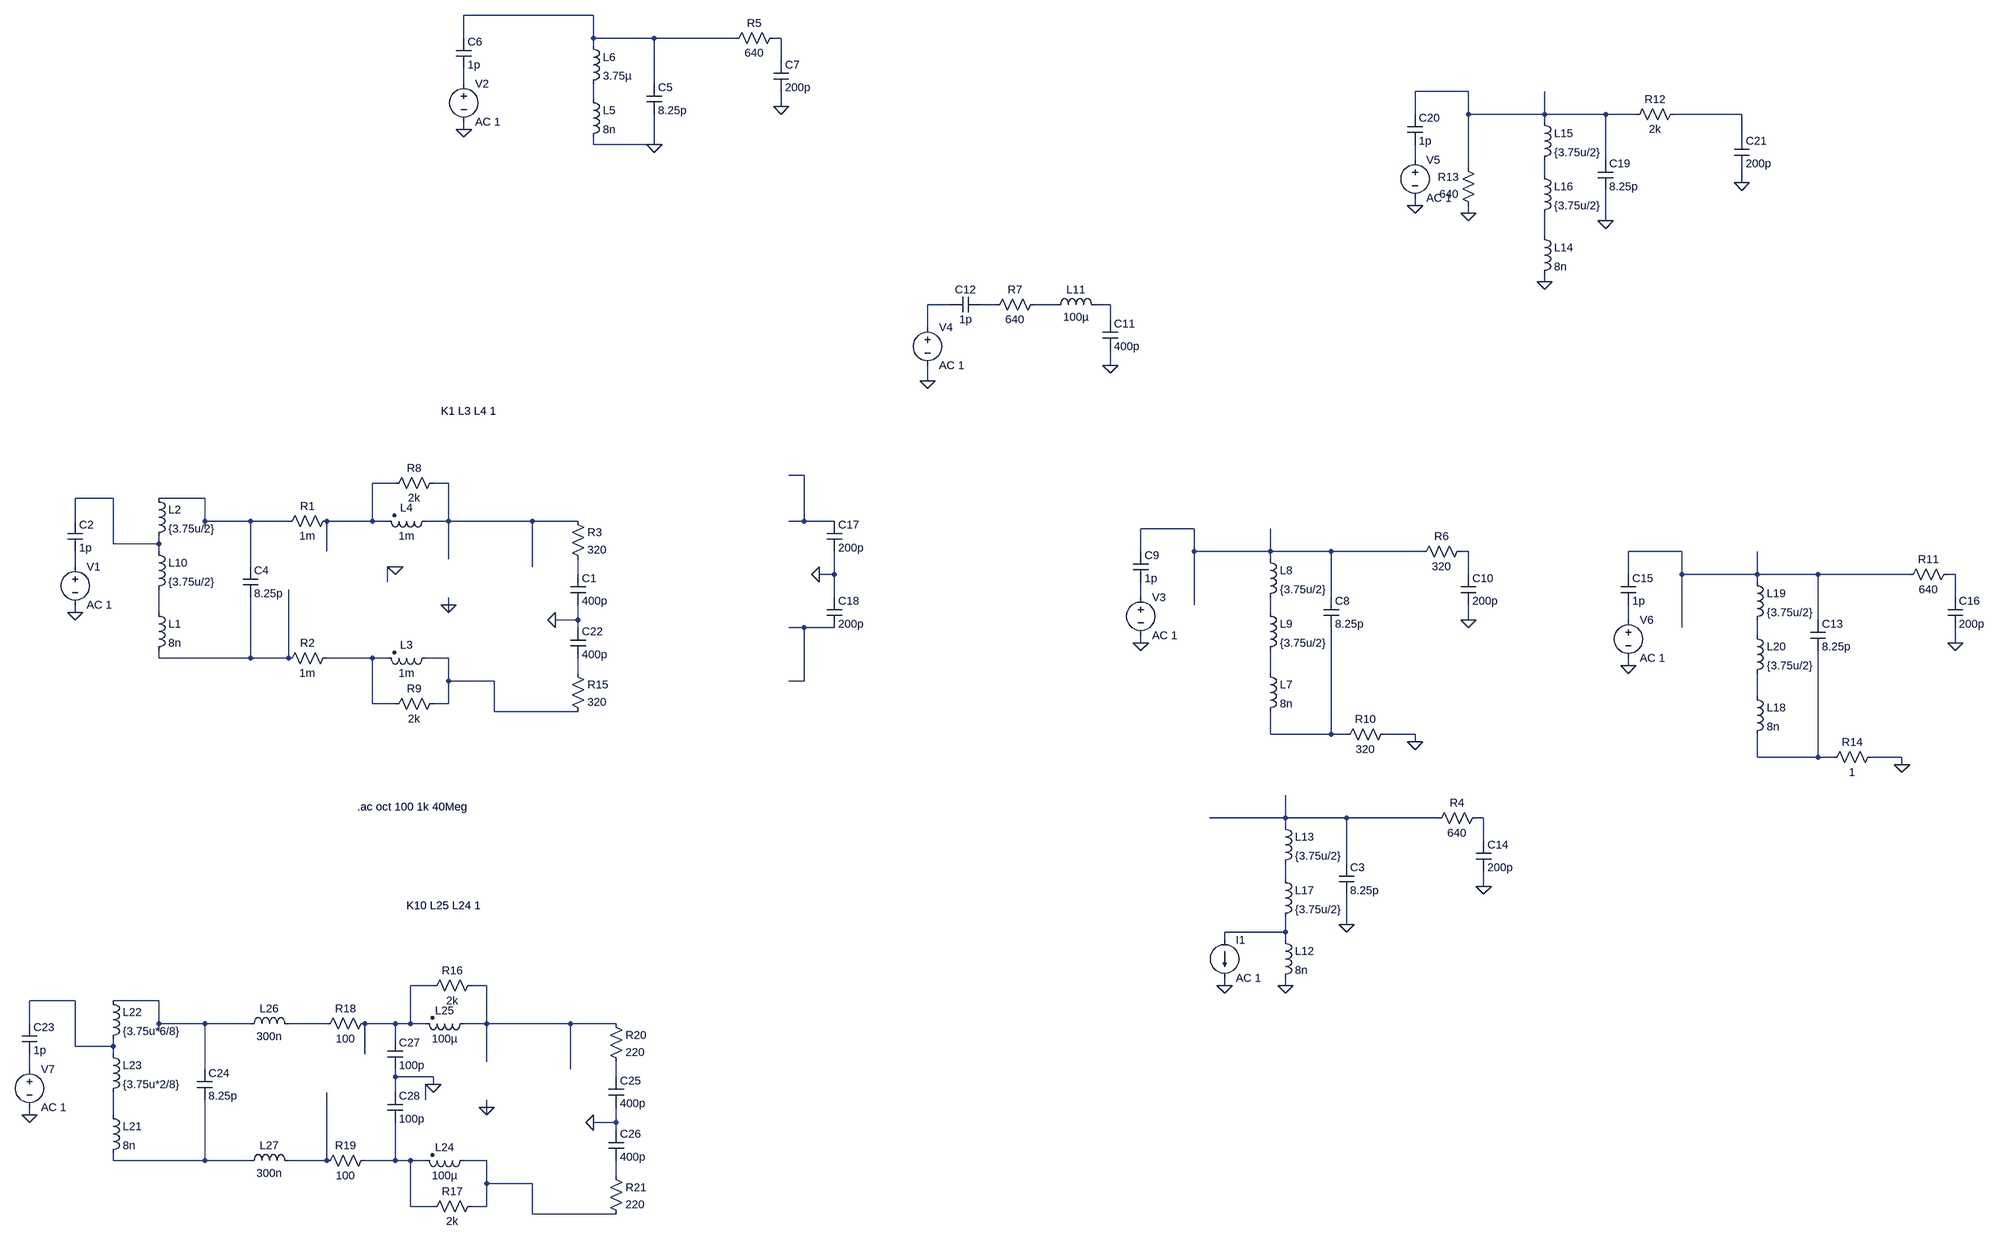
[diagram p0: schematic coil_sim.asc]
coil_sim.asc, the LTspice schematic file:
Version 4
SHEET 1 3080 1456
WIRE 48 -1120 -224 -1120
WIRE -224 -1072 -224 -1120
WIRE 48 -1072 48 -1120
WIRE 176 -1072 48 -1072
WIRE 368 -1072 176 -1072
WIRE 464 -1072 448 -1072
WIRE 48 -1056 48 -1072
WIRE 464 -1024 464 -1072
WIRE -224 -976 -224 -1008
WIRE 176 -976 176 -1072
WIRE 1984 -960 1872 -960
WIRE 48 -944 48 -976
WIRE 464 -928 464 -960
WIRE 1872 -912 1872 -960
WIRE 1984 -912 1984 -960
WIRE 2144 -912 2144 -960
WIRE 2144 -912 1984 -912
WIRE 2272 -912 2144 -912
WIRE 2336 -912 2272 -912
WIRE 2560 -912 2416 -912
WIRE 2144 -896 2144 -912
WIRE -224 -880 -224 -896
WIRE 2560 -864 2560 -912
WIRE 48 -848 48 -864
WIRE 176 -848 176 -912
WIRE 176 -848 48 -848
WIRE 1872 -816 1872 -848
WIRE 2272 -816 2272 -912
WIRE 1984 -800 1984 -912
WIRE 2144 -784 2144 -816
WIRE 2560 -768 2560 -800
WIRE 1872 -720 1872 -736
WIRE 1984 -704 1984 -720
WIRE 2272 -688 2272 -752
WIRE 2144 -656 2144 -704
WIRE 2144 -560 2144 -576
WIRE 896 -512 848 -512
WIRE 992 -512 960 -512
WIRE 1120 -512 1072 -512
WIRE 1232 -512 1200 -512
WIRE 1232 -480 1232 -512
WIRE 848 -464 848 -512
WIRE 1232 -384 1232 -416
WIRE 848 -352 848 -384
WIRE 512 -128 480 -128
WIRE -368 -112 -416 -112
WIRE -256 -112 -288 -112
WIRE -960 -80 -1040 -80
WIRE -768 -80 -864 -80
WIRE -1040 -32 -1040 -80
WIRE -768 -32 -768 -80
WIRE -672 -32 -768 -32
WIRE -592 -32 -672 -32
WIRE -416 -32 -416 -112
WIRE -416 -32 -512 -32
WIRE -384 -32 -416 -32
WIRE -256 -32 -256 -112
WIRE -256 -32 -304 -32
WIRE -80 -32 -256 -32
WIRE 16 -32 -80 -32
WIRE 512 -32 512 -128
WIRE 512 -32 480 -32
WIRE 576 -32 512 -32
WIRE -768 -16 -768 -32
WIRE 1408 -16 1296 -16
WIRE -960 16 -960 -80
WIRE -864 16 -864 0
WIRE -864 16 -960 16
WIRE -864 32 -864 16
WIRE -512 32 -512 -32
WIRE 1296 32 1296 -16
WIRE 1408 32 1408 -16
WIRE 1568 32 1568 -16
WIRE 1568 32 1408 32
WIRE 1696 32 1568 32
WIRE 1888 32 1696 32
WIRE 1984 32 1968 32
WIRE 2432 32 2320 32
WIRE -256 48 -256 -32
WIRE 1568 48 1568 32
WIRE -1040 64 -1040 32
WIRE -672 64 -672 -32
WIRE -80 64 -80 -32
WIRE 16 80 16 48
WIRE 576 80 576 32
WIRE 576 80 544 80
WIRE 1984 80 1984 32
WIRE 2320 80 2320 32
WIRE 2432 80 2432 32
WIRE 2592 80 2592 32
WIRE 2592 80 2432 80
WIRE 2720 80 2592 80
WIRE 2912 80 2720 80
WIRE 3008 80 2992 80
WIRE -384 96 -384 64
WIRE 2592 96 2592 80
WIRE 576 128 576 80
WIRE 1296 128 1296 96
WIRE 1696 128 1696 32
WIRE 3008 128 3008 80
WIRE -256 144 -256 128
WIRE 1408 144 1408 32
WIRE -1040 160 -1040 144
WIRE -864 160 -864 112
WIRE -256 160 -256 144
WIRE 1568 160 1568 128
WIRE 16 176 16 144
WIRE 16 176 -32 176
WIRE 1984 176 1984 144
WIRE 2320 176 2320 144
WIRE 2720 176 2720 80
WIRE 16 192 16 176
WIRE 512 192 480 192
WIRE 576 192 512 192
WIRE 2432 192 2432 80
WIRE 2592 208 2592 176
WIRE 1296 224 1296 208
WIRE 3008 224 3008 192
WIRE -864 256 -864 240
WIRE -672 256 -672 128
WIRE -672 256 -864 256
WIRE -592 256 -592 112
WIRE -592 256 -672 256
WIRE -416 256 -512 256
WIRE -384 256 -416 256
WIRE -256 256 -304 256
WIRE 2320 272 2320 256
WIRE 16 288 16 256
WIRE 1568 288 1568 240
WIRE -256 304 -256 256
WIRE -160 304 -256 304
WIRE 512 304 512 192
WIRE 512 304 480 304
WIRE 2592 336 2592 288
WIRE -416 352 -416 256
WIRE -368 352 -416 352
WIRE -256 352 -256 304
WIRE -256 352 -288 352
WIRE -160 368 -160 304
WIRE 16 368 -160 368
WIRE 1568 416 1568 368
WIRE 1696 416 1696 192
WIRE 1696 416 1568 416
WIRE 1728 416 1696 416
WIRE 1872 416 1808 416
WIRE 1872 432 1872 416
WIRE 2592 464 2592 416
WIRE 2720 464 2720 240
WIRE 2720 464 2592 464
WIRE 2752 464 2720 464
WIRE 2896 464 2832 464
WIRE 2896 480 2896 464
WIRE 1600 592 1600 544
WIRE 1600 592 1440 592
WIRE 1728 592 1600 592
WIRE 1920 592 1728 592
WIRE 2016 592 2000 592
WIRE 1600 608 1600 592
WIRE 2016 640 2016 592
WIRE 1728 688 1728 592
WIRE 1600 720 1600 688
WIRE 2016 736 2016 704
WIRE 1728 816 1728 752
WIRE 1600 832 1600 800
WIRE 1600 832 1472 832
WIRE 1472 848 1472 832
WIRE 1600 848 1600 832
WIRE -288 944 -336 944
WIRE -176 944 -208 944
WIRE 1472 944 1472 928
WIRE 1600 944 1600 928
WIRE -1040 976 -1136 976
WIRE -864 976 -960 976
WIRE -1136 1024 -1136 976
WIRE -864 1024 -864 976
WIRE -768 1024 -864 1024
WIRE -672 1024 -768 1024
WIRE -512 1024 -592 1024
WIRE -368 1024 -432 1024
WIRE -336 1024 -336 944
WIRE -336 1024 -368 1024
WIRE -304 1024 -336 1024
WIRE -176 1024 -176 944
WIRE -176 1024 -224 1024
WIRE 0 1024 -176 1024
WIRE 96 1024 0 1024
WIRE -864 1040 -864 1024
WIRE -368 1056 -368 1024
WIRE -1040 1072 -1040 976
WIRE -960 1072 -960 1056
WIRE -960 1072 -1040 1072
WIRE -960 1088 -960 1072
WIRE -432 1088 -432 1024
WIRE -176 1104 -176 1024
WIRE -1136 1120 -1136 1088
WIRE -768 1120 -768 1024
WIRE 0 1120 0 1024
WIRE -368 1136 -368 1120
WIRE -288 1136 -368 1136
WIRE 96 1136 96 1104
WIRE -288 1152 -288 1136
WIRE -368 1168 -368 1136
WIRE -304 1184 -304 1152
WIRE -176 1200 -176 1184
WIRE -1136 1216 -1136 1200
WIRE -960 1216 -960 1168
WIRE -176 1216 -176 1200
WIRE 96 1232 96 1200
WIRE 96 1232 48 1232
WIRE 96 1248 96 1232
WIRE -960 1312 -960 1296
WIRE -768 1312 -768 1184
WIRE -768 1312 -960 1312
WIRE -672 1312 -768 1312
WIRE -512 1312 -512 1168
WIRE -512 1312 -592 1312
WIRE -368 1312 -368 1232
WIRE -368 1312 -432 1312
WIRE -336 1312 -368 1312
WIRE -304 1312 -336 1312
WIRE -176 1312 -224 1312
WIRE 96 1344 96 1312
WIRE -176 1360 -176 1312
WIRE -80 1360 -176 1360
WIRE -336 1408 -336 1312
WIRE -288 1408 -336 1408
WIRE -176 1408 -176 1360
WIRE -176 1408 -208 1408
WIRE -80 1424 -80 1360
WIRE 96 1424 -80 1424
FLAG -1040 160 0
FLAG -224 -880 0
FLAG 176 -848 0
FLAG 464 -928 0
FLAG 1296 224 0
FLAG 1984 176 0
FLAG 1232 -384 0
FLAG 848 -352 0
FLAG 544 80 0
FLAG 1872 -720 0
FLAG 2272 -688 0
FLAG 2560 -768 0
FLAG 2144 -560 0
FLAG 1984 -704 0
FLAG -256 144 0
FLAG -368 64 0
FLAG 1728 816 0
FLAG 2016 736 0
FLAG 1600 944 0
FLAG 1472 944 0
FLAG 1872 432 0
FLAG 2320 272 0
FLAG 3008 224 0
FLAG 2896 480 0
FLAG -32 176 0
FLAG -1136 1216 0
FLAG -176 1200 0
FLAG -288 1152 0
FLAG 48 1232 0
SYMBOL cap -1056 -32 R0
SYMATTR InstName C2
SYMATTR Value 1p
SYMBOL voltage -1040 48 R0
WINDOW 123 0 0 Left 0
WINDOW 39 0 0 Left 0
SYMATTR InstName V1
SYMATTR Value AC 1
SYMBOL ind 32 -960 R0
SYMATTR InstName L5
SYMATTR Value 8n
SYMATTR SpiceLine Rser=0
SYMBOL ind 32 -1072 R0
SYMATTR InstName L6
SYMATTR Value 3.75µ
SYMBOL cap 160 -976 R0
SYMATTR InstName C5
SYMATTR Value 8.25p
SYMBOL cap -240 -1072 R0
SYMATTR InstName C6
SYMATTR Value 1p
SYMBOL voltage -224 -992 R0
WINDOW 123 0 0 Left 0
WINDOW 39 0 0 Left 0
SYMATTR InstName V2
SYMATTR Value AC 1
SYMBOL res 464 -1088 R90
WINDOW 0 0 56 VBottom 2
WINDOW 3 32 56 VTop 2
SYMATTR InstName R5
SYMATTR Value 640
SYMBOL cap 448 -1024 R0
SYMATTR InstName C7
SYMATTR Value 200p
SYMBOL ind 1552 272 R0
SYMATTR InstName L7
SYMATTR Value 8n
SYMATTR SpiceLine Rser=0
SYMBOL ind 1552 32 R0
SYMATTR InstName L8
SYMATTR Value {3.75u/2}
SYMBOL cap 1680 128 R0
SYMATTR InstName C8
SYMATTR Value 8.25p
SYMBOL cap 1280 32 R0
SYMATTR InstName C9
SYMATTR Value 1p
SYMBOL voltage 1296 112 R0
WINDOW 123 0 0 Left 0
WINDOW 39 0 0 Left 0
SYMATTR InstName V3
SYMATTR Value AC 1
SYMBOL res 1984 16 R90
WINDOW 0 0 56 VBottom 2
WINDOW 3 32 56 VTop 2
SYMATTR InstName R6
SYMATTR Value 320
SYMBOL cap 1968 80 R0
SYMATTR InstName C10
SYMATTR Value 200p
SYMBOL ind 1552 144 R0
SYMATTR InstName L9
SYMATTR Value {3.75u/2}
SYMBOL ind -880 144 R0
SYMATTR InstName L1
SYMATTR Value 8n
SYMATTR SpiceLine Rser=0
SYMBOL ind -880 -96 R0
SYMATTR InstName L2
SYMATTR Value {3.75u/2}
SYMBOL ind -880 16 R0
SYMATTR InstName L10
SYMATTR Value {3.75u/2}
SYMBOL res 1088 -528 R90
WINDOW 0 0 56 VBottom 2
WINDOW 3 32 56 VTop 2
SYMATTR InstName R7
SYMATTR Value 640
SYMBOL ind 1104 -496 R270
WINDOW 0 32 56 VTop 2
WINDOW 3 5 56 VBottom 2
SYMATTR InstName L11
SYMATTR Value 100µ
SYMBOL cap 1216 -480 R0
SYMATTR InstName C11
SYMATTR Value 400p
SYMBOL voltage 848 -480 R0
WINDOW 123 0 0 Left 0
WINDOW 39 0 0 Left 0
SYMATTR InstName V4
SYMATTR Value AC 1
SYMBOL cap 960 -528 R90
WINDOW 0 0 32 VBottom 2
WINDOW 3 32 32 VTop 2
SYMATTR InstName C12
SYMATTR Value 1p
SYMBOL cap 560 -32 R0
SYMATTR InstName C17
SYMATTR Value 200p
SYMBOL cap 560 128 R0
SYMATTR InstName C18
SYMATTR Value 200p
SYMBOL ind 2128 -672 R0
SYMATTR InstName L14
SYMATTR Value 8n
SYMATTR SpiceLine Rser=0
SYMBOL ind 2128 -912 R0
SYMATTR InstName L15
SYMATTR Value {3.75u/2}
SYMBOL cap 2256 -816 R0
SYMATTR InstName C19
SYMATTR Value 8.25p
SYMBOL cap 1856 -912 R0
SYMATTR InstName C20
SYMATTR Value 1p
SYMBOL voltage 1872 -832 R0
WINDOW 123 0 0 Left 0
WINDOW 39 0 0 Left 0
SYMATTR InstName V5
SYMATTR Value AC 1
SYMBOL cap 2544 -864 R0
SYMATTR InstName C21
SYMATTR Value 200p
SYMBOL ind 2128 -800 R0
SYMATTR InstName L16
SYMATTR Value {3.75u/2}
SYMBOL res 2432 -928 R90
WINDOW 0 0 56 VBottom 2
WINDOW 3 32 56 VTop 2
SYMATTR InstName R12
SYMATTR Value 2k
SYMBOL res 2000 -704 R180
WINDOW 0 36 76 Left 2
WINDOW 3 36 40 Left 2
SYMATTR InstName R13
SYMATTR Value 640
SYMBOL ind2 -288 240 R90
WINDOW 0 4 56 VBottom 2
WINDOW 3 32 56 VTop 2
SYMATTR InstName L3
SYMATTR Value 1m
SYMATTR Type ind
SYMBOL ind2 -288 -48 R90
WINDOW 0 4 56 VBottom 2
WINDOW 3 32 56 VTop 2
SYMATTR InstName L4
SYMATTR Value 1m
SYMATTR Type ind
SYMBOL cap -688 64 R0
SYMATTR InstName C4
SYMATTR Value 8.25p
SYMBOL res -272 -128 R90
WINDOW 0 0 56 VBottom 2
WINDOW 3 32 56 VTop 2
SYMATTR InstName R8
SYMATTR Value 2k
SYMBOL res -272 336 R90
WINDOW 0 0 56 VBottom 2
WINDOW 3 32 56 VTop 2
SYMATTR InstName R9
SYMATTR Value 2k
SYMBOL res -608 -16 R270
WINDOW 0 32 56 VTop 2
WINDOW 3 0 56 VBottom 2
SYMATTR InstName R1
SYMATTR Value 1m
SYMBOL res -608 272 R270
WINDOW 0 32 56 VTop 2
WINDOW 3 0 56 VBottom 2
SYMATTR InstName R2
SYMATTR Value 1m
SYMBOL res 0 -48 R0
SYMATTR InstName R3
SYMATTR Value 320
SYMBOL cap 0 80 R0
SYMATTR InstName C1
SYMATTR Value 400p
SYMBOL ind 1584 832 R0
SYMATTR InstName L12
SYMATTR Value 8n
SYMATTR SpiceLine Rser=0
SYMBOL ind 1584 592 R0
SYMATTR InstName L13
SYMATTR Value {3.75u/2}
SYMBOL cap 1712 688 R0
SYMATTR InstName C3
SYMATTR Value 8.25p
SYMBOL res 2016 576 R90
WINDOW 0 0 56 VBottom 2
WINDOW 3 32 56 VTop 2
SYMATTR InstName R4
SYMATTR Value 640
SYMBOL cap 2000 640 R0
SYMATTR InstName C14
SYMATTR Value 200p
SYMBOL ind 1584 704 R0
SYMATTR InstName L17
SYMATTR Value {3.75u/2}
SYMBOL current 1472 848 R0
WINDOW 123 0 0 Left 0
WINDOW 39 0 0 Left 0
SYMATTR InstName I1
SYMATTR Value AC 1
SYMBOL res 1824 400 R90
WINDOW 0 0 56 VBottom 2
WINDOW 3 32 56 VTop 2
SYMATTR InstName R10
SYMATTR Value 320
SYMBOL ind 2576 320 R0
SYMATTR InstName L18
SYMATTR Value 8n
SYMATTR SpiceLine Rser=0
SYMBOL ind 2576 80 R0
SYMATTR InstName L19
SYMATTR Value {3.75u/2}
SYMBOL cap 2704 176 R0
SYMATTR InstName C13
SYMATTR Value 8.25p
SYMBOL cap 2304 80 R0
SYMATTR InstName C15
SYMATTR Value 1p
SYMBOL voltage 2320 160 R0
WINDOW 123 0 0 Left 0
WINDOW 39 0 0 Left 0
SYMATTR InstName V6
SYMATTR Value AC 1
SYMBOL res 3008 64 R90
WINDOW 0 0 56 VBottom 2
WINDOW 3 32 56 VTop 2
SYMATTR InstName R11
SYMATTR Value 640
SYMBOL cap 2992 128 R0
SYMATTR InstName C16
SYMATTR Value 200p
SYMBOL ind 2576 192 R0
SYMATTR InstName L20
SYMATTR Value {3.75u/2}
SYMBOL res 2848 448 R90
WINDOW 0 0 56 VBottom 2
WINDOW 3 32 56 VTop 2
SYMATTR InstName R14
SYMATTR Value 1
SYMBOL cap 0 192 R0
SYMATTR InstName C22
SYMATTR Value 400p
SYMBOL res 0 272 R0
SYMATTR InstName R15
SYMATTR Value 320
SYMBOL cap -1152 1024 R0
SYMATTR InstName C23
SYMATTR Value 1p
SYMBOL voltage -1136 1104 R0
WINDOW 123 0 0 Left 0
WINDOW 39 0 0 Left 0
SYMATTR InstName V7
SYMATTR Value AC 1
SYMBOL ind -976 1200 R0
SYMATTR InstName L21
SYMATTR Value 8n
SYMATTR SpiceLine Rser=0
SYMBOL ind -976 960 R0
SYMATTR InstName L22
SYMATTR Value {3.75u*6/8}
SYMBOL ind -976 1072 R0
SYMATTR InstName L23
SYMATTR Value {3.75u*2/8}
SYMBOL ind2 -208 1296 R90
WINDOW 0 4 56 VBottom 2
WINDOW 3 32 56 VTop 2
SYMATTR InstName L24
SYMATTR Value 100µ
SYMATTR Type ind
SYMBOL ind2 -208 1008 R90
WINDOW 0 4 56 VBottom 2
WINDOW 3 32 56 VTop 2
SYMATTR InstName L25
SYMATTR Value 100µ
SYMATTR Type ind
SYMBOL cap -784 1120 R0
SYMATTR InstName C24
SYMATTR Value 8.25p
SYMBOL res -192 928 R90
WINDOW 0 0 56 VBottom 2
WINDOW 3 32 56 VTop 2
SYMATTR InstName R16
SYMATTR Value 2k
SYMBOL res -192 1392 R90
WINDOW 0 0 56 VBottom 2
WINDOW 3 32 56 VTop 2
SYMATTR InstName R17
SYMATTR Value 2k
SYMBOL res -528 1040 R270
WINDOW 0 32 56 VTop 2
WINDOW 3 0 56 VBottom 2
SYMATTR InstName R18
SYMATTR Value 100
SYMBOL res -528 1328 R270
WINDOW 0 32 56 VTop 2
WINDOW 3 0 56 VBottom 2
SYMATTR InstName R19
SYMATTR Value 100
SYMBOL res 80 1008 R0
SYMATTR InstName R20
SYMATTR Value 220
SYMBOL cap 80 1136 R0
SYMATTR InstName C25
SYMATTR Value 400p
SYMBOL cap 80 1248 R0
SYMATTR InstName C26
SYMATTR Value 400p
SYMBOL res 80 1328 R0
SYMATTR InstName R21
SYMATTR Value 220
SYMBOL cap -384 1056 R0
SYMATTR InstName C27
SYMATTR Value 100p
SYMBOL cap -384 1168 R0
SYMATTR InstName C28
SYMATTR Value 100p
SYMBOL ind -688 1040 R270
WINDOW 0 32 56 VTop 2
WINDOW 3 5 56 VBottom 2
SYMATTR InstName L26
SYMATTR Value 300n
SYMBOL ind -688 1328 R270
WINDOW 0 32 56 VTop 2
WINDOW 3 5 56 VBottom 2
SYMATTR InstName L27
SYMATTR Value 300n
TEXT -448 568 Left 2 !.ac oct 100 1k 40Meg
TEXT -272 -288 Left 2 !K1 L3 L4 1
TEXT -344 776 Left 2 !K10 L25 L24 1

The netlist it stands for:
* coil_sim.asc
C2 N017 N022 1p
V1 N022 0 AC 1
L5 N005 0 8n Rser=0
L6 N001 N005 3.75µ
C5 N001 0 8.25p
C6 N001 N003 1p
V2 N003 0 AC 1
R5 N002 N001 640
C7 N002 0 200p
L7 N036 N038 8n Rser=0
L8 N019 N028 {3.75u/2}
C8 N019 N038 8.25p
C9 N019 N026 1p
V3 N026 0 AC 1
R6 N020 N019 320
C10 N020 0 200p
L9 N028 N036 {3.75u/2}
L1 N027 N032 8n Rser=0
L2 N018 N017 {3.75u/2}
L10 N017 N027 {3.75u/2}
R7 N012 N011 640
L11 N012 N013 100µ
C11 N013 0 400p
V4 N010 0 AC 1
C12 N011 N010 1p
C17 N014 0 200p
C18 0 N030 200p
L14 N009 0 8n Rser=0
L15 N004 N008 {3.75u/2}
C19 N004 0 8.25p
C20 N004 N007 1p
V5 N007 0 AC 1
C21 N006 0 200p
L16 N008 N009 {3.75u/2}
R12 N006 N004 2k
R13 0 N004 640
L3 N034 N033 1m
L4 N016 N015 1m
C4 N018 N032 8.25p
R8 N016 N015 2k
R9 N034 N033 2k
R1 N018 N015 1m
R2 N032 N033 1m
R3 N016 N023 320
C1 N023 0 400p
L12 N043 0 8n Rser=0
L13 N040 N042 {3.75u/2}
C3 N040 0 8.25p
R4 N041 N040 640
C14 N041 0 200p
L17 N042 N043 {3.75u/2}
I1 N043 0 AC 1
R10 0 N038 320
L18 N037 N039 8n Rser=0
L19 N021 N031 {3.75u/2}
C13 N021 N039 8.25p
C15 N021 N029 1p
V6 N029 0 AC 1
R11 N024 N021 640
C16 N024 0 200p
L20 N031 N037 {3.75u/2}
R14 0 N039 1
C22 0 N035 400p
R15 N035 N034 320
C23 N046 N049 1p
V7 N049 0 AC 1
L21 N052 N053 8n Rser=0
L22 N047 N046 {3.75u*6/8}
L23 N046 N052 {3.75u*2/8}
L24 N056 N055 100µ
L25 N045 N044 100µ
C24 N047 N053 8.25p
R16 N045 N044 2k
R17 N056 N055 2k
R18 N048 N044 100
R19 N054 N055 100
R20 N045 N050 220
C25 N050 0 400p
C26 0 N057 400p
R21 N057 N056 220
C27 N044 0 100p
C28 0 N055 100p
L26 N047 N048 300n
L27 N053 N054 300n
.ac oct 100 1k 40Meg
K1 L3 L4 1
K10 L25 L24 1
.backanno
.end